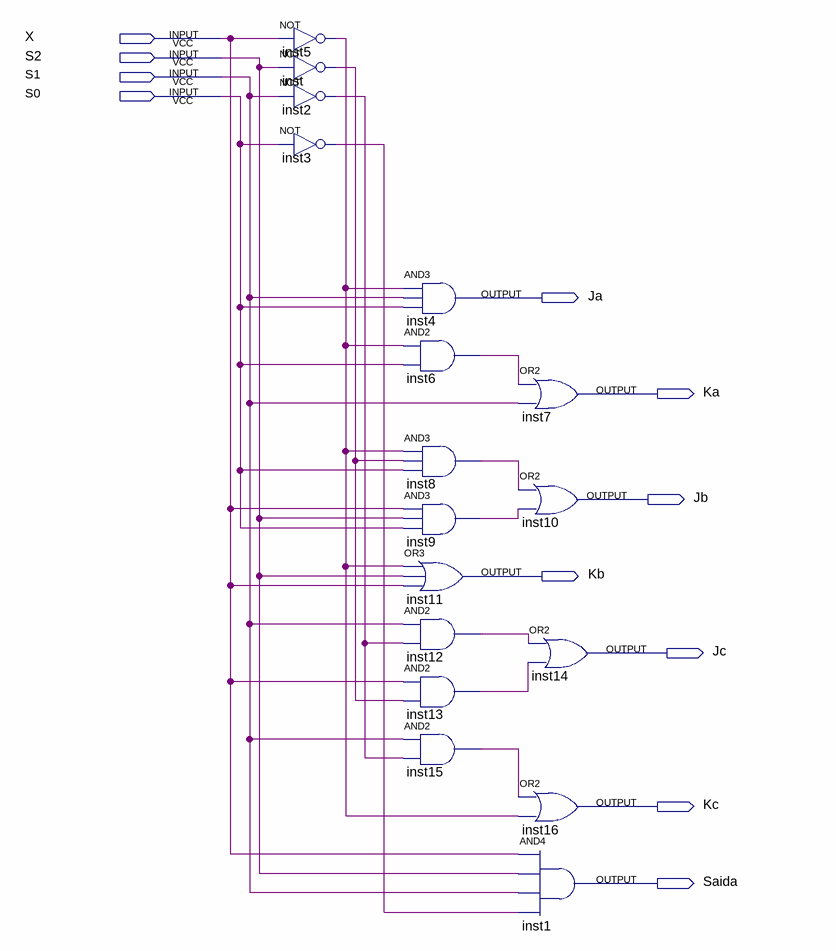
[diagram p0: schematic sheet]
// Quartus schematic Detector_53.bdf as structural Verilog: 17 symbols, 11 pins
module Detector_53 (
  input  X,
  input  S2,
  input  S1,
  input  S0,
  output Ja,
  output Ka,
  output Jb,
  output Kb,
  output Jc,
  output Kc,
  output Saida
);

  wire inst2_out, inst3_out, inst5_out, inst6_out, inst8_out, inst9_out, inst12_out, inst13_out, inst15_out,
       inst_out;

  not inst5 (inst5_out, X);
  not inst (inst_out, S2);
  not inst2 (inst2_out, S1);
  not inst3 (inst3_out, S0);
  and inst4 (Ja, inst5_out, S1, S0);
  and inst6 (inst6_out, inst5_out, S0);
  and inst8 (inst8_out, inst5_out, inst_out, S0);
  and inst9 (inst9_out, X, S2, S0);
  or inst11 (Kb, inst5_out, S2, X);
  and inst12 (inst12_out, S1, inst2_out);
  and inst13 (inst13_out, X, inst_out);
  and inst15 (inst15_out, S1, inst2_out);
  or inst7 (Ka, inst6_out, S1);
  // OR2 inst10 has open pins: IN1=inst8_out, IN2=inst9_out, OUT=open
  or inst14 (Jc, inst12_out, inst13_out);
  or inst16 (Kc, inst15_out, inst5_out);
  and inst1 (Saida, X, S2, S1, inst3_out);
endmodule
